# Altium schematic sheet stm32.SchDoc
size A3; PageSetup: Record=PageOptions|CenterHorizontal=True|CenterVertical=True|PrintScale=0.73|XCorrection=1.00|YCorrection=1.00|PrintKind=0|BorderSize=5000000|LeftOffset=0|BottomOffset=0|Orientation=2|PaperLength=1000|PaperWidth=1000|Scale=100|PaperSource=7|PrintQuality=600|MediaType=1|DitherType=10|PaperKind=A4|PrintScaleMode=1
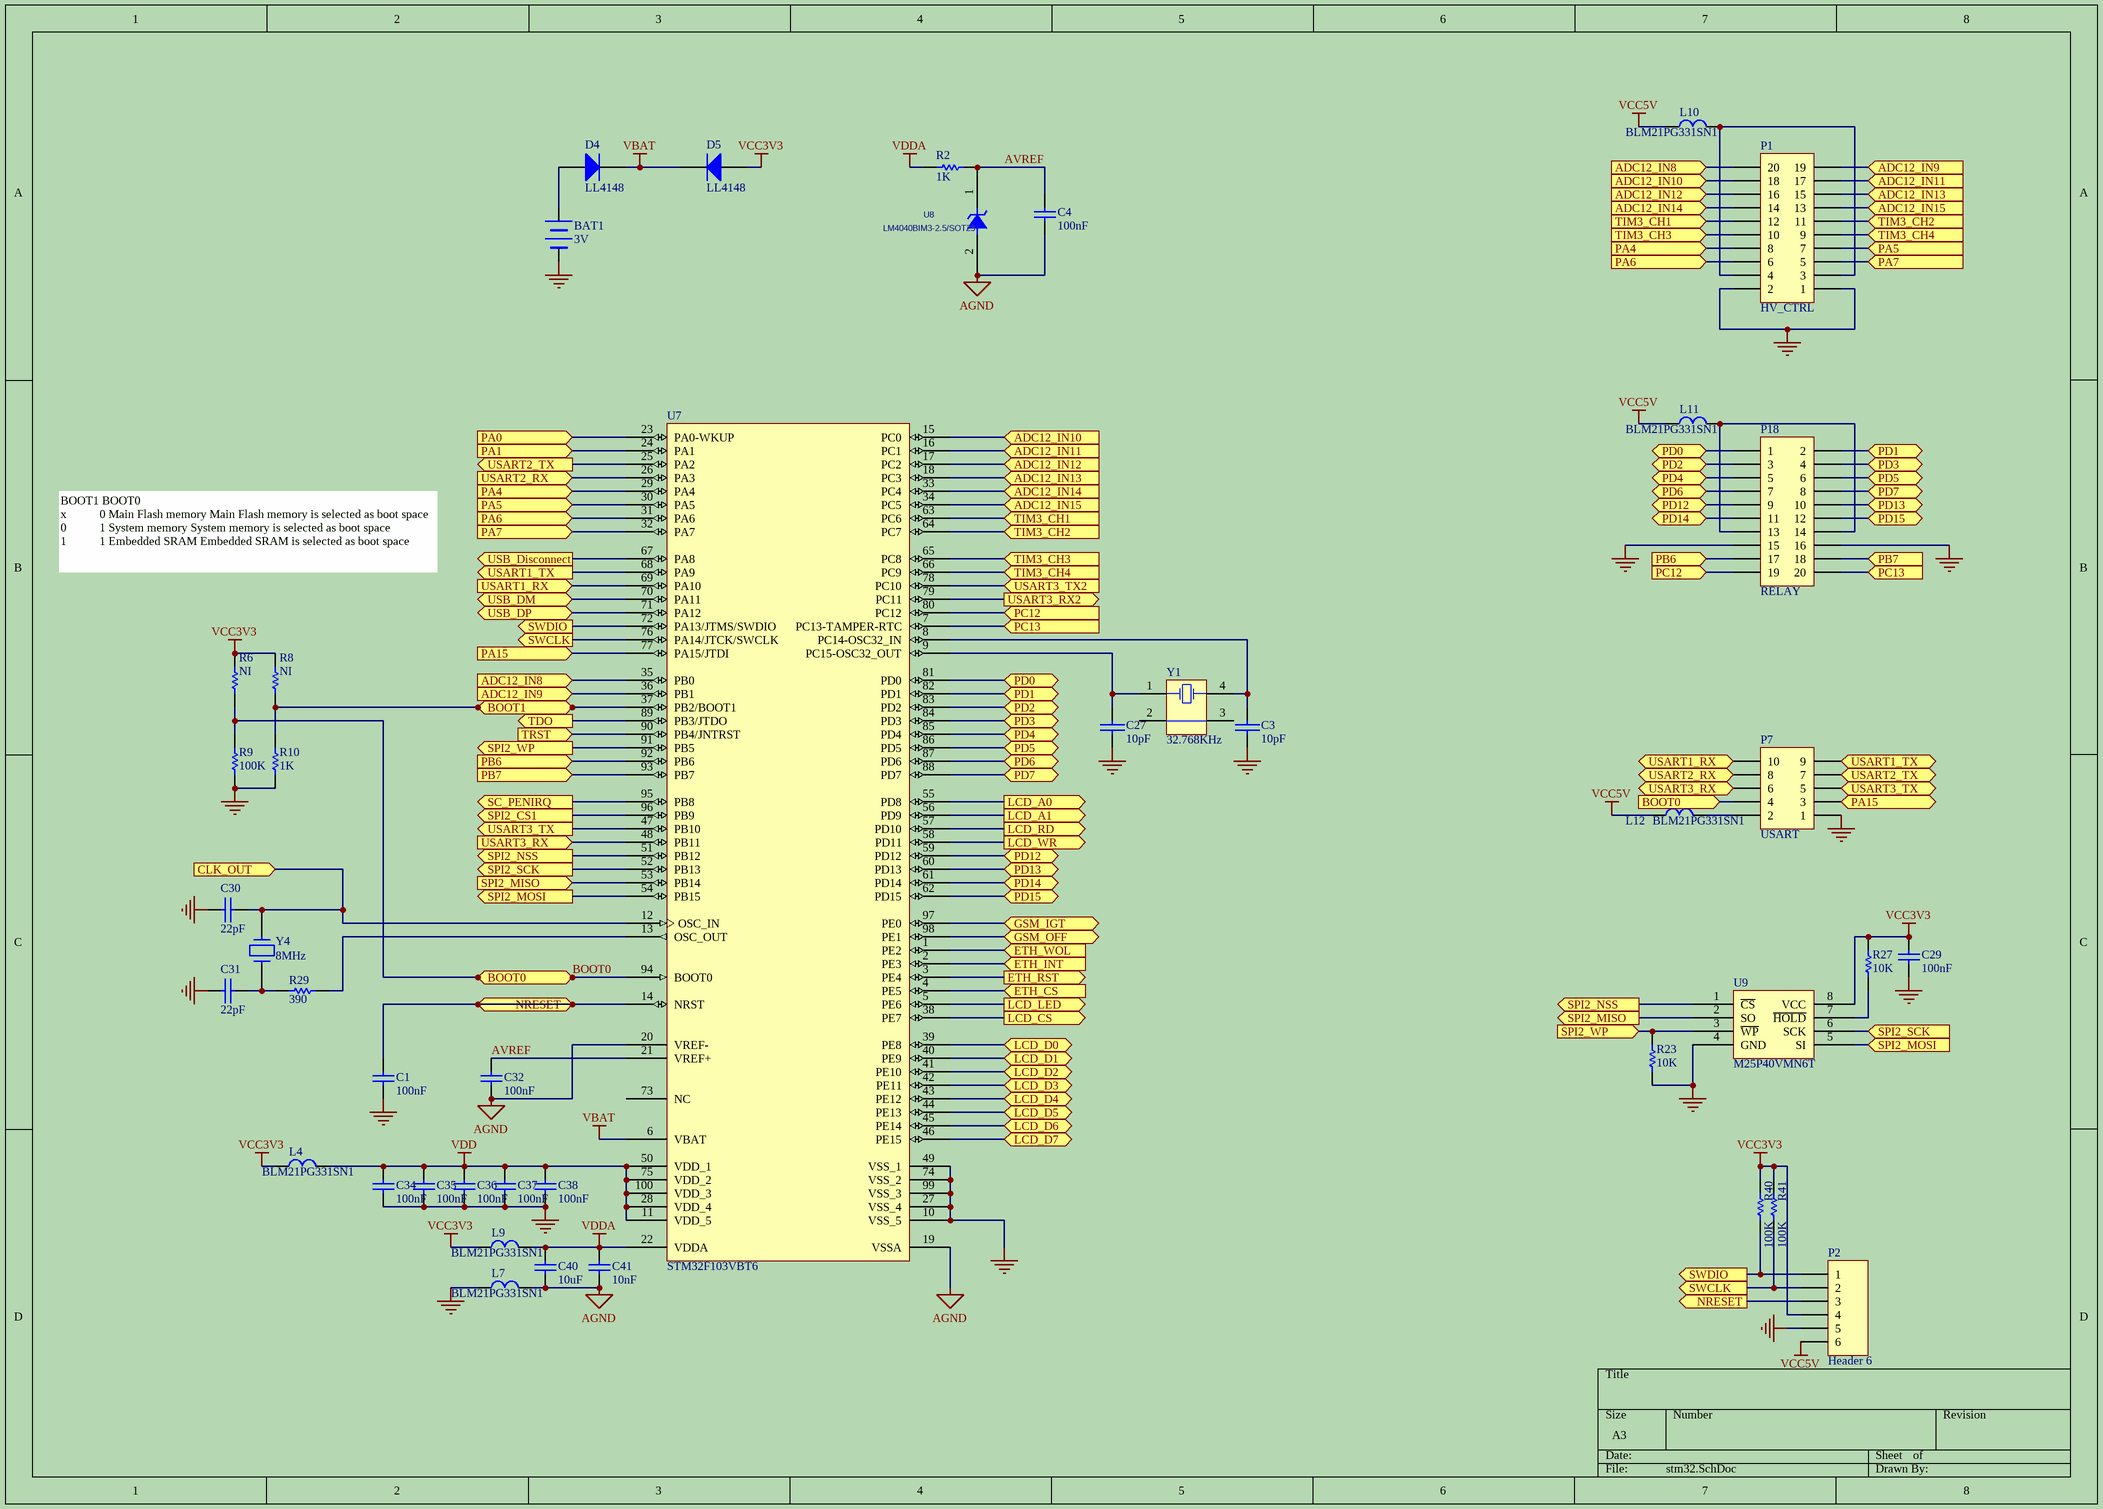
[diagram p0: stm32.SchDoc]

## Parts
BAT1  3V  [battery]
C1  100nF  [C0805]
C3  10pF  [C0805]
C4  100nF  [C0805]
C27  10pF  [C0805]
C29  100nF  [C0805]
C30  22pF  [C0805]
C31  22pF  [C0805]
C32  100nF  [C0805]
C34  100nF  [C0805]
C35  100nF  [C0805]
C36  100nF  [C0805]
C37  100nF  [C0805]
C38  100nF  [C0805]
C40  10uF  [C1206]
C41  10nF  [C0805]
D4  LL4148  [D1206]
D5  LL4148  [D1206]
L4  BLM21PG331SN1  [L0805]
L7  BLM21PG331SN1  [L0805]
L9  BLM21PG331SN1  [L0805]
L10  BLM21PG331SN1  [L0805]
L11  BLM21PG331SN1  [L0805]
L12  BLM21PG331SN1  [L0805]
P1  HV_CTRL  [IDC20-EJ]
P2  Header 6  [TJC3-6A]
P7  USART  [IDC10-EJ]
P18  RELAY  [IDC20-EJ]
R2  1K  [R0805]
R6  NI  [R0805]
R8  NI  [R0805]
R9  100K  [R0805]
R10  1K  [R0805]
R23  10K  [R0805]
R27  10K  [R0805]
R29  390  [R0805]
R40  100K  [R0805]
R41  100K  [R0805]
U7  STM32F103VBT6  [LQFP100_N]
U8  LM4040BIM3-2.5/SOT23  [sot-23]
U9  M25P40VMN6T  [SO8]
Y1  32.768KHz  [DSO-N4]
Y4  8MHz  [CRYSTAL2]

## Ports
ADC12_IN8 (in), ADC12_IN9 (in), ADC12_IN10 (in), ADC12_IN11 (in), ADC12_IN12 (in), ADC12_IN13 (in), ADC12_IN14 (in), ADC12_IN15 (in), BOOT0 (in), BOOT1 (in), CLK_OUT (in), ETH_CS (in), ETH_INT (in), ETH_RST (out), ETH_WOL (in), GSM_IGT, GSM_OFF, LCD_A0 (out), LCD_A1 (out), LCD_CS (out), LCD_D0, LCD_D1, LCD_D2, LCD_D3, LCD_D4, LCD_D5, LCD_D6, LCD_D7, LCD_LED (out), LCD_RD (out), LCD_WR (out), NRESET (out), PA0 (in), PA1 (in), PA4 (in), PA5 (in), PA6 (in), PA7 (in), PA15 (in), PB6 (in), PB7 (in), PC12 (in), PC13 (in), PD0, PD1, PD2, PD3, PD4, PD5, PD6, PD7, PD12, PD13, PD14, PD15, SC_PENIRQ (out), SPI2_CS1 (out), SPI2_MISO (in), SPI2_MISO (out), SPI2_MOSI (in), SPI2_MOSI (out), SPI2_NSS (out), SPI2_SCK (in), SPI2_SCK (out), SPI2_WP (in), SPI2_WP (out), SWCLK (out), SWDIO (out), TDO (out), TIM3_CH1 (in), TIM3_CH2 (in), TIM3_CH3 (in), TIM3_CH4 (in), TRST (in), USART1_RX (in), USART1_TX (out), USART2_RX (in), USART2_TX (out), USART3_RX2 (out), USART3_RX (in), USART3_TX2 (in), USART3_TX (out), USB_Disconnect (out), USB_DM (bidir), USB_DP (bidir)

## Nets
AGND: C4.1 C32.1 C40.1 C41.1 L7.2 U7.19(VSSA) U7.20(VREF-) U8.2(A)
GND: BAT1.2 C1.1 C3.2 C27.2 C29.1 C30.2 C31.2 C34.1 C35.1 C36.1 C37.1 C38.1 L7.1 P1.1 P1.2 P2.5 P7.1 P18.15 P18.16 R9.2 R10.2 R23.2 U7.10(VSS_5) U7.27(VSS_4) U7.49(VSS_1) U7.74(VSS_2) U7.99(VSS_3) U9.4(GND)
VBAT: D4.2(K) D5.2(K) U7.6(VBAT)
VCC3V3: C29.2 D5.1(A) L4.1 L9.1 P2.4 R6.1 R8.1 R27.2 R40.2 R41.2 U9.8(VCC)
VCC5V: L10.1 L11.1 L12.1 P2.6
VDD: C34.2 C35.2 C36.2 C37.2 C38.2 L4.2 U7.11(VDD_5) U7.28(VDD_4) U7.50(VDD_1) U7.75(VDD_2) U7.100(VDD_3)
VDDA: C40.2 C41.2 L9.2 R2.1 U7.22(VDDA)
ADC12_IN8: P1.20 U7.35(PB0) ; port ADC12_IN8
ADC12_IN9: P1.19 U7.36(PB1) ; port ADC12_IN9
ADC12_IN10: P1.18 U7.15(PC0) ; port ADC12_IN10
ADC12_IN11: P1.17 U7.16(PC1) ; port ADC12_IN11
ADC12_IN12: P1.16 U7.17(PC2) ; port ADC12_IN12
ADC12_IN13: P1.15 U7.18(PC3) ; port ADC12_IN13
ADC12_IN14: P1.14 U7.33(PC4) ; port ADC12_IN14
ADC12_IN15: P1.13 U7.34(PC5) ; port ADC12_IN15
AVREF: C4.2 C32.2 R2.2 U7.21(VREF+) U8.1(K)
BOOT0: P7.4 R6.2 R9.1 U7.94(BOOT0) ; port BOOT0
BOOT1: R8.2 R10.1 U7.37(PB2/BOOT1) ; port BOOT1
CLK_OUT: C30.1 U7.12(OSC_IN) Y4.2 ; port CLK_OUT
ETH_CS: U7.4(PE5) ; port ETH_CS
ETH_INT: U7.2(PE3) ; port ETH_INT
ETH_RST: U7.3(PE4) ; port ETH_RST
ETH_WOL: U7.1(PE2) ; port ETH_WOL
GSM_IGT: U7.97(PE0) ; port GSM_IGT
GSM_OFF: U7.98(PE1) ; port GSM_OFF
LCD_A0: U7.55(PD8) ; port LCD_A0
LCD_A1: U7.56(PD9) ; port LCD_A1
LCD_CS: U7.38(PE7) ; port LCD_CS
LCD_D0: U7.39(PE8) ; port LCD_D0
LCD_D1: U7.40(PE9) ; port LCD_D1
LCD_D2: U7.41(PE10) ; port LCD_D2
LCD_D3: U7.42(PE11) ; port LCD_D3
LCD_D4: U7.43(PE12) ; port LCD_D4
LCD_D5: U7.44(PE13) ; port LCD_D5
LCD_D6: U7.45(PE14) ; port LCD_D6
LCD_D7: U7.46(PE15) ; port LCD_D7
LCD_LED: U7.5(PE6) ; port LCD_LED
LCD_RD: U7.57(PD10) ; port LCD_RD
LCD_WR: U7.58(PD11) ; port LCD_WR
NRESET: C1.2 P2.3 U7.14(NRST) ; port NRESET
PA0: U7.23(PA0-WKUP) ; port PA0
PA1: U7.24(PA1) ; port PA1
PA4: P1.8 U7.29(PA4) ; port PA4
PA5: P1.7 U7.30(PA5) ; port PA5
PA6: P1.6 U7.31(PA6) ; port PA6
PA7: P1.5 U7.32(PA7) ; port PA7
PA15: P7.3 U7.77(PA15/JTDI) ; port PA15
PB6: P18.17 U7.92(PB6) ; port PB6
PB7: P18.18 U7.93(PB7) ; port PB7
PC12: P18.19 U7.80(PC12) ; port PC12
PC13: P18.20 U7.7(PC13-TAMPER-RTC) ; port PC13
PD0: P18.1 U7.81(PD0) ; port PD0
PD1: P18.2 U7.82(PD1) ; port PD1
PD2: P18.3 U7.83(PD2) ; port PD2
PD3: P18.4 U7.84(PD3) ; port PD3
PD4: P18.5 U7.85(PD4) ; port PD4
PD5: P18.6 U7.86(PD5) ; port PD5
PD6: P18.7 U7.87(PD6) ; port PD6
PD7: P18.8 U7.88(PD7) ; port PD7
PD12: P18.9 U7.59(PD12) ; port PD12
PD13: P18.10 U7.60(PD13) ; port PD13
PD14: P18.11 U7.61(PD14) ; port PD14
PD15: P18.12 U7.62(PD15) ; port PD15
SC_PENIRQ: U7.95(PB8) ; port SC_PENIRQ
SPI2_CS1: U7.96(PB9) ; port SPI2_CS1
SPI2_MISO: U7.53(PB14) U9.2(SO) ; port SPI2_MISO
SPI2_MOSI: U7.54(PB15) U9.5(SI) ; port SPI2_MOSI
SPI2_NSS: U7.51(PB12) U9.1(~{CS}) ; port SPI2_NSS
SPI2_SCK: U7.52(PB13) U9.6(SCK) ; port SPI2_SCK
SPI2_WP: R23.1 U7.91(PB5) U9.3(~{WP}) ; port SPI2_WP
SWCLK: P2.2 R41.1 U7.76(PA14/JTCK/SWCLK) ; port SWCLK
SWDIO: P2.1 R40.1 U7.72(PA13/JTMS/SWDIO) ; port SWDIO
TDO: U7.89(PB3/JTDO) ; port TDO
TIM3_CH1: P1.12 U7.63(PC6) ; port TIM3_CH1
TIM3_CH2: P1.11 U7.64(PC7) ; port TIM3_CH2
TIM3_CH3: P1.10 U7.65(PC8) ; port TIM3_CH3
TIM3_CH4: P1.9 U7.66(PC9) ; port TIM3_CH4
TRST: U7.90(PB4/JNTRST) ; port TRST
USART1_RX: P7.10 U7.69(PA10) ; port USART1_RX
USART1_TX: P7.9 U7.68(PA9) ; port USART1_TX
USART2_RX: P7.8 U7.26(PA3) ; port USART2_RX
USART2_TX: P7.7 U7.25(PA2) ; port USART2_TX
USART3_RX: P7.6 U7.48(PB11) ; port USART3_RX
USART3_RX2: U7.79(PC11) ; port USART3_RX2
USART3_TX: P7.5 U7.47(PB10) ; port USART3_TX
USART3_TX2: U7.78(PC10) ; port USART3_TX2
USB_Disconnect: U7.67(PA8) ; port USB_Disconnect
USB_DM: U7.70(PA11) ; port USB_DM
USB_DP: U7.71(PA12) ; port USB_DP
NetBAT1_1: BAT1.1 D4.1(A)
NetC3_1: C3.1 U7.8(PC14-OSC32_IN) Y1.4(OSC2)
NetC27_1: C27.1 U7.9(PC15-OSC32_OUT) Y1.1(OSC1)
NetC31_1: C31.1 R29.2 Y4.1
NetL10_2: L10.2 P1.3 P1.4
NetL11_2: L11.2 P18.13 P18.14
NetL12_2: L12.2 P7.2
NetR27_1: R27.1 U9.7(~{HOLD})
NetR29_1: R29.1 U7.13(OSC_OUT)

Not connected (* = marked no-connect by the designer): U7 73(NC); Y1 2(COM) 3(COM)

## Notes on the sheet
- BOOT1 BOOT0
  x           0 Main Flash memory Main Flash memory is selected as boot space
  0           1 System memory System memory is selected as boot space
  1           1 Embedded SRAM Embedded SRAM is selected as boot space

## Library data of the parts
BAT1 = BATTERY
C1 C32 C34-C38 C40 C41 = CAP: Capacitor; Value: 100pF; Published: 8-Jun-2000; Revision: July-2002: Re-released for DXP Platform.; Publisher: Altium Limited
C3 C27 C30 C31 = CAP: Capacitor
C4 C29 = Cap: Capacitor; Value: 100pF; Published: 8-Jun-2000; LatestRevisionDate: 17-Jul-2002; LatestRevisionNote: Re-released for DXP Platform.; PackageReference: RAD-0.3; Publisher: Altium Limited
D4 D5 = Diode: Default Diode; Published: 8-Jun-2000; LatestRevisionDate: 17-Jul-2002; LatestRevisionNote: Re-released for DXP Platform.; PackageVersion: Sep-1996; PackageReference: SMC; Publisher: Altium Limited; Code_JEDEC: DO-214-AB
L4 L7 L9-L12 = L1
P1 P18 = Header 10X2: Header, 10-Pin, Dual row; LatestRevisionDate: 17-Jul-2002; LatestRevisionNote: Re-released for DXP Platform.; Publisher: Altium Limited
P2 = Header 6: Header, 6-Pin; LatestRevisionDate: 17-Jul-2002; LatestRevisionNote: Re-released for DXP Platform.; Publisher: Altium Limited
P7 = Header 5X2: Header, 5-Pin, Dual row; LatestRevisionDate: 17-Jul-2002; LatestRevisionNote: Re-released for DXP Platform.; Publisher: Altium Limited
R2 R10 = res1: Resistor; Published: 8-Jun-2000; Revision: July-2002: Re-released for DXP Platform.; Publisher: Altium Limited; Value: 1K
R6 R8 R9 R23 = res1: Resistor; Value: 1K; Published: 8-Jun-2000; Revision: July-2002: Re-released for DXP Platform.; Publisher: Altium Limited
R27 R29 R40 R41 = Res1: Resistor; Value: 1K; Published: 8-Jun-2000; Publisher: Altium Limited
  R27 R40 R41: LatestRevisionDate: 17-Jul-2002; LatestRevisionNote: Re-released for DXP Platform.; PackageReference: AXIAL-0.3
  R29: Revision: July-2002: Re-released for DXP Platform.
U7 = STM32F103VBT6: STM32 ARM-based 32-bit MCU with 64 Kbytes Flash, 100-pin LQFP, Industrial Temperature; Published: *; DatasheetVersion: *; PackageVersion: *; PackageReference: *; Publisher: *; PackageDescription: *; ComponentLink1Description: *; ComponentLink1URL: *; ComponentLink2Description: *; ComponentLink2URL: *
U8 = LM4040/SOT23
U9 = SPI_FLASH
Y1 = ECS-35-17-7S: Crystal Oscillator; Published: 17-Jul-2002; DatasheetDocument: 18-Apr-2000; PackageReference: ECX-3S; Publisher: Altium Limited; ComponentLink1Description: Manufacturer Link; ComponentLink1URL: http://www.ecsxtal.com/; ComponentLink2Description: Datasheet; ComponentLink2URL: http://www.ecsxtal.com/pdf/ecx-3s.pdf
Y4 = CRYSTAL